# EAGLE design EHDD_LAB_4 (EAGLE 7.7.0)
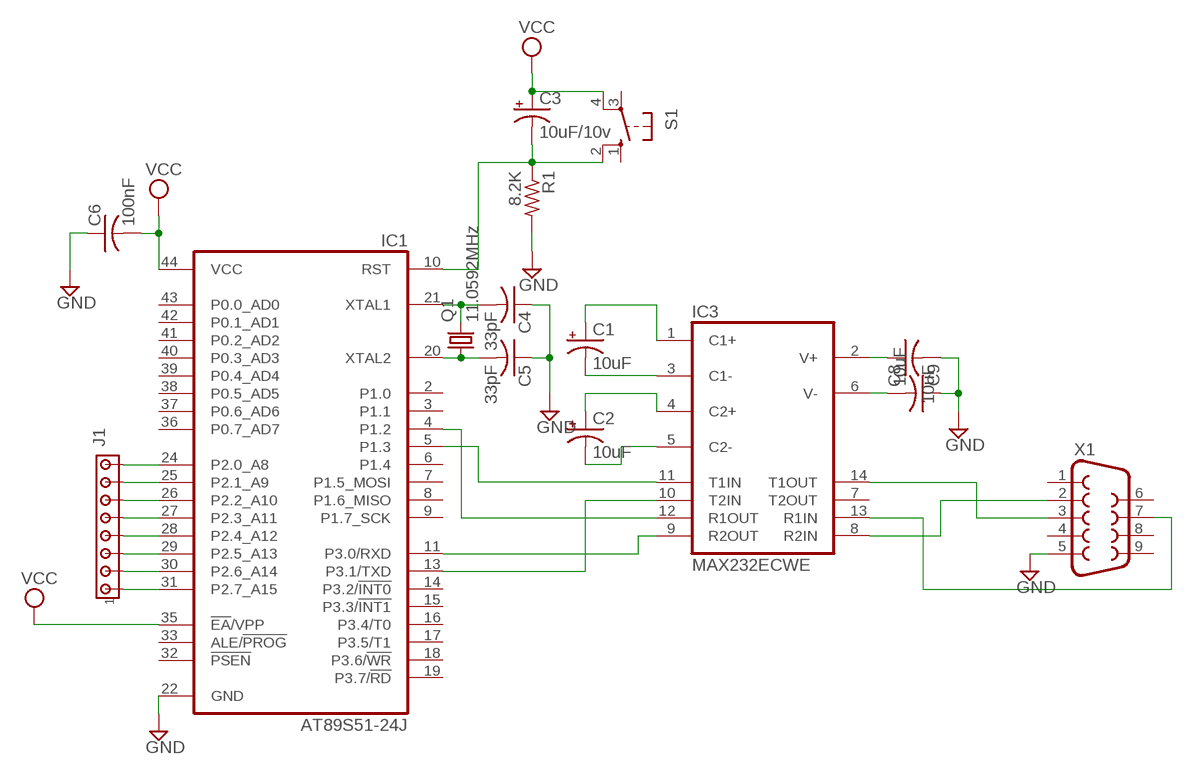
[diagram p0: schematic, sheet 1]

## Parts
C1  10uF  CPOL-US153CLV-0405  [153CLV-0405]
C2  10uF  CPOL-US153CLV-0405  [153CLV-0405]
C3  10uF/10v  CPOL-US153CLV-0405  [153CLV-0405]
C4  33pF  C-USC0805  [C0805]
C5  33pF  C-USC0805  [C0805]
C6  100nF  C-USC0805  [C0805]
C8  10uF  C-USC0805  [C0805]
C9  10uF  C-USC0805  [C0805]
IC1  AT89S51-24J  [PLCC44]
IC3  MAX232ECWE  [SO16L]
J1  MTA08-100  [10X08MTA]
Q1  11.0592MHz  CRYSTALTC38H  [TC38H]
R1  8.2K  R-US_R0805  [R0805]
S1  10-XX  [B3F-10XX]
X1  F09V  [F09V]

## Nets
GND: C4.1 C5.1 C6.1 C8.2 C9.1 IC1.22(GND) R1.2 X1.5
N$1: IC1.5(P1.3) IC3.11(T1IN)
N$2: IC1.13(P3.1/TXD) IC3.10(T2IN)
N$3: IC1.4(P1.2) IC3.12(R1OUT)
N$4: IC1.11(P3.0/RXD) IC3.9(R2OUT)
N$5: C2.- IC3.5(C2-)
N$6: C2.+ IC3.4(C2+)
N$7: C1.- IC3.3(C1-)
N$8: C1.+ IC3.1(C1+)
N$9: C9.2 IC3.6(V-)
N$10: C8.1 IC3.2(V+)
N$12: IC3.14(T1OUT) X1.3
N$13: IC3.8(R2IN) X1.2
N$14: IC3.13(R1IN) X1.7
N$16: IC1.24(P2.0_A8) J1.8
N$17: IC1.25(P2.1_A9) J1.7
N$18: IC1.26(P2.2_A10) J1.6
N$19: IC1.27(P2.3_A11) J1.5
N$20: IC1.28(P2.4_A12) J1.4
N$21: IC1.29(P2.5_A13) J1.3
N$22: IC1.30(P2.6_A14) J1.2
N$23: IC1.31(P2.7_A15) J1.1
N$24: C5.2 IC1.20(XTAL2) Q1.1
N$25: C4.2 IC1.21(XTAL1) Q1.2
N$27: C3.- IC1.10(RST) R1.1 S1.2(S1)
VCC: C3.+ C6.2 IC1.35(!EA!/VPP) IC1.44(VCC) S1.4(P1)
Unconnected: IC1.2(P1.0) IC1.3(P1.1) IC1.6(P1.4) IC1.7(P1.5_MOSI) IC1.8(P1.6_MISO) IC1.9(P1.7_SCK) IC1.14(P3.2/!INT0) IC1.15(P3.3/!INT1) IC1.16(P3.4/T0) IC1.17(P3.5/T1) IC1.18(P3.6/!WR) IC1.19(P3.7/!RD) IC1.32(!PSEN) IC1.33(ALE/!PROG) IC1.36(P0.7_AD7) IC1.37(P0.6_AD6) IC1.38(P0.5_AD5) IC1.39(P0.4_AD4) IC1.40(P0.3_AD3) IC1.41(P0.2_AD2) IC1.42(P0.1_AD1) IC1.43(P0.0_AD0) IC3.7(T2OUT) S1.1(S) S1.3(P) X1.1 X1.4 X1.6 X1.8 X1.9

## Power pins joined to a net without a drawn wire
GND: IC3.15(GND)
VCC: IC3.16(VCC)

## Library data of the parts
C1-C3 = rcl:CPOL-US: POLARIZED CAPACITOR, American symbol
C4-C6 C8 C9 = rcl:C-US: CAPACITOR, American symbol
IC1 = atmel:AT89S51-*: 8-bit Microcontroller with 4K BytesIn-System Programmable Flash Source: http://www.atmel.com/dyn/resources/prod_documents/doc2487.pdf; MPN: AT89S51-24JU; OC_FARNELL: 1095738; OC_NEWARK: 96K6577
IC3 = maxim:MAX232ECWE: RS232 TRANSCEIVER; MF: MAXIM; MPN: MAX232ECWE+; OC_FARNELL: 9724435; OC_NEWARK: 67K4440
J1 = con-amp:MTA08-100: AMP connector
Q1 = crystal:CRYSTAL: CRYSTAL; OC_FARNELL: unknown; OC_NEWARK: unknown
R1 = rcl:R-US_: RESISTOR, American symbol
S1 = switch-omron:10-XX: OMRON SWITCH; MPN: B3F-1000; OC_FARNELL: 176432; OC_NEWARK: 36M3542
X1 = con-subd:F09: SUB-D; OC_FARNELL: unknown; OC_NEWARK: unknown

## Board
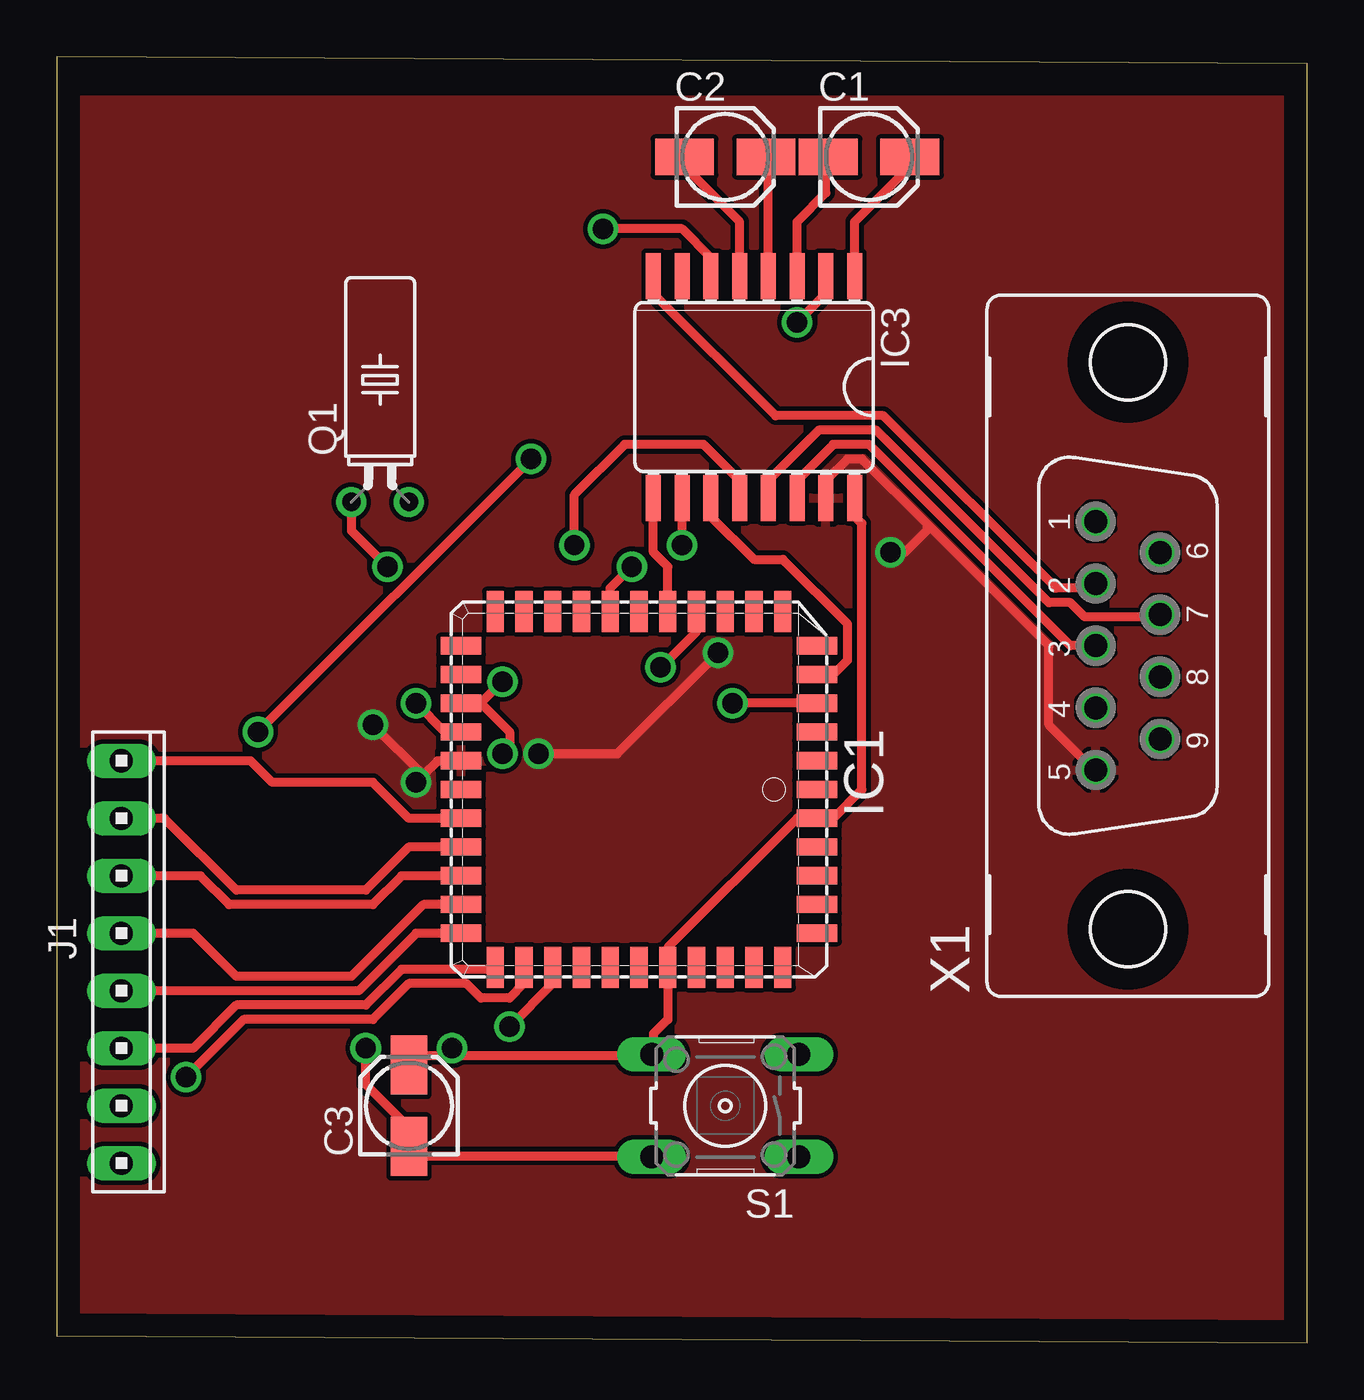
[diagram p1: board, top side]
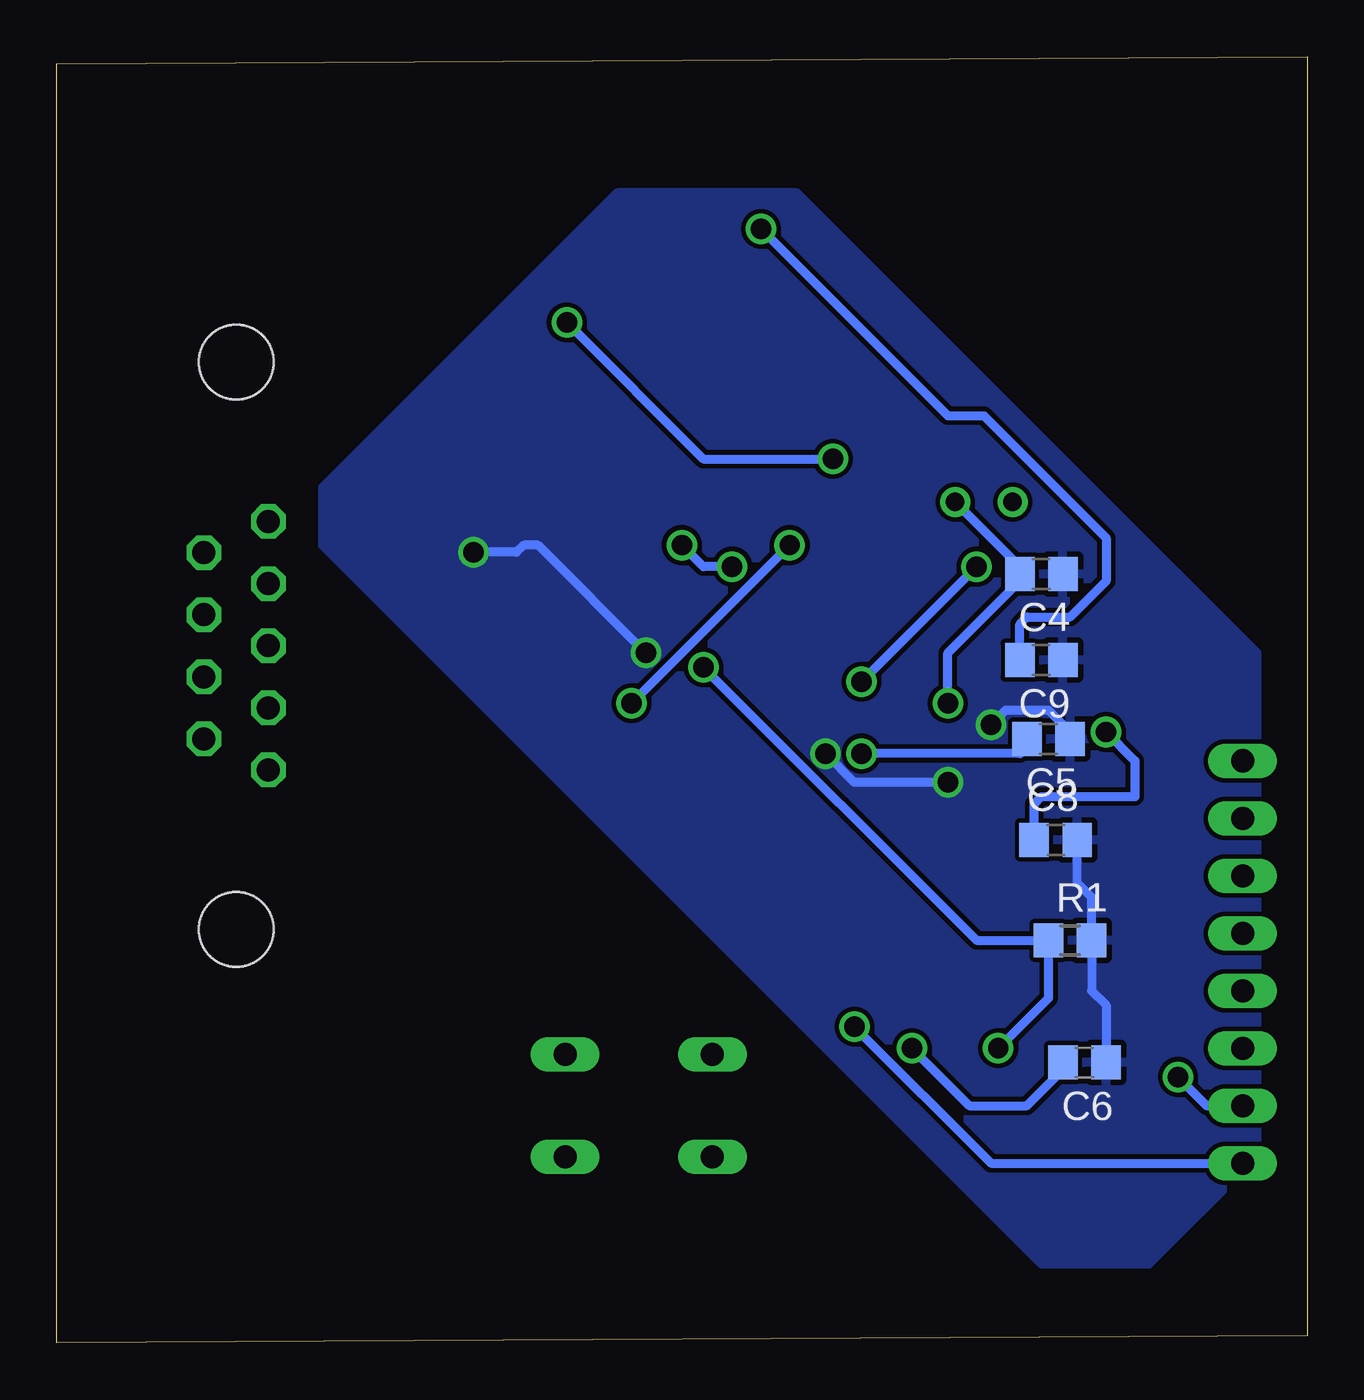
[diagram p2: board, bottom side, seen from below]

Size 55.23 x 56.82 mm. Coordinates in mm from the lower left corner, seen from the top.
Outline: 0,0.32 55.23,0 55.23,56.51 0,56.82 0,0.32
Copper layers (1*16): Top 0.035mm / dielectric 1.5mm / Bottom 0.035mm
Design rules "default": minimum track width 10mil, minimum drill 24mil, track to track 8mil, track to pad 8mil, pad to pad 8mil, via to via 8mil, smd to smd 8mil, copper to edge 40mil, drill to drill 8mil, minimum pad ring 10mil, minimum via ring 8mil, stop-mask expansion 4mil, vias tented up to drill 0mil, thermal gap 10mil

### Footprints (pad centres in the part's own frame; a part is rotated, then mirrored left to right if it is on the bottom)
153CLV-0405 = smd 2.6 x 1.6: + 1.8,0; - -1.8,0
C0805 = smd 1.3 x 1.5: 1 -0.95,0; 2 0.95,0
PLCC44 = smd 1.8 x 0.76: 1 -7.86,0; 2 -7.86,-1.27; 3 -7.86,-2.54; 4 -7.86,-3.81; 5 -7.86,-5.08; 6 -7.86,-6.35; 18 7.86,-6.35; 19 7.86,-5.08; 20 7.86,-3.81; 21 7.86,-2.54; 22 7.86,-1.27; 23 7.86,0; 24 7.86,1.27; 25 7.86,2.54; 26 7.86,3.81; 27 7.86,5.08; 28 7.86,6.35; 40 -7.86,6.35; 41 -7.86,5.08; 42 -7.86,3.81; 43 -7.86,2.54; 44 -7.86,1.27 | smd 0.76 x 1.8: 7 -6.35,-7.86; 8 -5.08,-7.86; 9 -3.81,-7.86; 10 -2.54,-7.86; 11 -1.27,-7.86; 12 0,-7.86; 13 1.27,-7.86; 14 2.54,-7.86; 15 3.81,-7.86; 16 5.08,-7.86; 17 6.35,-7.86; 29 6.35,7.86; 30 5.08,7.86; 31 3.81,7.86; 32 2.54,7.86; 33 1.27,7.86; 34 0,7.86; 35 -1.27,7.86; 36 -2.54,7.86; 37 -3.81,7.86; 38 -5.08,7.86; 39 -6.35,7.86
SO16L = smd 0.66 x 2.032: 1 -4.445,-4.902; 2 -3.175,-4.902; 3 -1.905,-4.902; 4 -0.635,-4.902; 5 0.635,-4.902; 6 1.905,-4.902; 7 3.175,-4.902; 8 4.445,-4.902; 9 4.445,4.902; 10 3.175,4.902; 11 1.905,4.902; 12 0.635,4.902; 13 -0.635,4.902; 14 -1.905,4.902; 15 -3.175,4.902; 16 -4.445,4.902
10X08MTA = drill 1.016 long: 1 8.89,0; 2 6.35,0; 3 3.81,0; 4 1.27,0; 5 -1.27,0; 6 -3.81,0; 7 -6.35,0; 8 -8.89,0
TC38H = drill 0.813: 1 -1.27,0; 2 1.27,0
R0805 = smd 1.3 x 1.5: 1 -0.95,0; 2 0.95,0
B3F-10XX = drill 1.016 long: 1 -3.251,2.261; 2 3.251,2.261; 3 -3.251,-2.261; 4 3.251,-2.261
F09V = drill 1.016 octagon: 1 5.486,1.422; 2 2.743,1.422; 3 0,1.422; 4 -2.743,1.422; 5 -5.486,1.422; 6 4.115,-1.422; 7 1.372,-1.422; 8 -1.372,-1.422; 9 -4.115,-1.422 | hole 3.302: -12.522,0; 12.522,0

### Placement (x,y rotation side)
C1  35.88,52.39 0 top
C2  29.53,52.39 0 top
C3  15.56,10.48 90 top
C4  11.75,33.97 180 bottom
C5  11.43,26.67 180 bottom
C6  9.84,12.38 180 bottom
C8  11.11,22.22 0 bottom
C9  11.75,30.16 180 bottom
IC1  25.72,24.45 180 top
IC3  30.8,42.23 180 top
J1  2.86,16.83 270 top
Q1  14.29,37.15 0 top
R1  10.48,17.78 0 bottom
S1  29.53,10.48 180 top
X1  47.31,30.8 90 top

### Tracks (layer width: path | path; a pad name or v marks a point on that pad's centre or on a via)
GND  (via drill 0.9)
  Top 0.406: IC3.15 33.97,38.1 34.92,39.05 35.56,39.05 38.42,36.19 | 38.42,36.19 43.81,30.8 43.81,27.31 45.72,25.4 X1.5 | 38.42,36.19 38.42,35.88 37.47,34.93 v36.83,34.93 | v29.21,30.48 24.77,26.04 v21.27,26.04 | 16.19,25.08 16.83,25.72 IC1.22 | v13.97,27.31 16.19,25.08 | 16.19,25.08 v15.88,24.77
  Bottom 0.406: R1.2 9.53,15.56 8.89,14.92 C6.1 | R1.2 9.53,19.68 10.16,20.32 C8.2 | R1.2 | v36.83,34.93 34.92,34.93 34.61,35.24 33.97,35.24 v29.21,30.48 | v21.27,26.04 20,24.77 v15.88,24.77 | v13.97,27.31 13.34,27.94 11.43,27.94 10.48,26.99 C5.1
  pour Top: 0,54.93 54.61,54.93 54.61,0.32 0,0.32
  pour Bottom: 22.54,50.8 30.48,50.8 43.5,37.78 43.5,35.24 11.75,3.49 6.99,3.49 2.22,8.26 2.22,30.48
N$1
  Top 0.406: IC3.11 28.89,36.51 30.8,34.61 32.07,34.61 34.92,31.75 34.92,30.16 34.29,29.53 IC1.5
N$2  (via drill 0.9)
  Top 0.406: v27.62,35.24 IC3.10 | v25.4,34.29 24.45,33.34 IC1.13
  Bottom 0.406: v27.62,35.24 26.67,34.29 v25.4,34.29
N$3  (via drill 0.9)
  Top 0.406: IC3.12 30.16,38.1 28.57,39.69 25.08,39.69 22.86,37.47 v22.86,35.24 | IC1.4 v29.84,28.26
  Bottom 0.406: v29.84,28.26 v22.86,35.24
N$4
  Top 0.406: IC3.9 26.35,34.93 26.99,34.29 IC1.11
N$5
  Top 0.406: IC3.5 30.16,49.53 27.94,51.75 27.94,52.39 C2.-
N$6
  Top 0.406: IC3.4 31.43,52.39 C2.+
N$7
  Top 0.406: IC3.3 32.7,49.53 33.97,50.8 33.97,52.39 C1.-
N$8
  Top 0.406: IC3.1 35.24,49.53 37.47,51.75 37.47,52.39 C1.+
N$9  (via drill 0.9)
  Top 0.406: v24.13,49.21 27.62,49.21 28.89,47.94 IC3.6
  Bottom 0.406: C9.2 12.7,31.75 12.38,32.07 10.48,32.07 8.89,33.65 8.89,35.56 14.29,40.96 15.88,40.96 v24.13,49.21
N$10  (via drill 0.9)
  Top 0.406: v20.95,39.05 v8.89,26.99 | v32.7,45.08 33.97,46.36 IC3.2
  Bottom 0.406: C8.1 12.06,23.81 11.75,24.13 7.62,24.13 7.62,25.72 v8.89,26.99 | v20.95,39.05 26.67,39.05 v32.7,45.08
N$12
  Top 0.406: IC3.14 32.7,38.1 34.29,39.69 35.88,39.69 44.77,30.8 X1.3
N$13
  Top 0.406: IC3.8 26.35,46.36 31.75,40.96 36.51,40.96 44.13,33.34 45.72,33.34 X1.2
N$14
  Top 0.406: IC3.13 31.43,38.1 33.66,40.32 36.2,40.32 43.81,32.7 44.77,32.7 45.4,32.07 48.58,32.07 X1.7
N$16
  Top 0.406: J1.8 8.57,25.72 9.53,24.77 13.97,24.77 15.56,23.18 IC1.24
N$17
  Top 0.406: J1.7 4.76,23.18 7.94,20 13.65,20 15.56,21.91 IC1.25
N$18
  Top 0.406: J1.6 6.35,20.64 7.62,19.37 13.97,19.37 15.24,20.64 IC1.26
N$19
  Top 0.406: J1.5 6.03,18.1 7.94,16.19 13.02,16.19 16.19,19.37 IC1.27
N$20
  Top 0.406: J1.4 13.34,15.56 15.88,18.1 IC1.28
N$21
  Top 0.406: J1.3 6.03,13.02 7.94,14.92 13.65,14.92 15.24,16.51 19.37,16.51 IC1.29
N$22  (via drill 0.9)
  Top 0.406: v5.71,11.75 8.26,14.29 13.97,14.29 15.56,15.87 18.1,15.87 18.73,15.24 20,15.24 20.64,15.87 IC1.30
  Bottom 0.406: J1.2 4.45,10.48 v5.71,11.75
N$23  (via drill 0.9)
  Top 0.406: v20,13.97 21.91,15.87 IC1.31
  Bottom 0.406: J1.1 13.97,7.94 v20,13.97
N$24  (via drill 0.9)
  Top 0.406: 18.73,28.26 20,26.99 20,25.72 v19.68,26.04 | v19.68,29.21 18.73,28.26 | v14.61,34.29 13.02,35.88 Q1.1 | 18.73,28.26 IC1.20
  Bottom 0.406: v19.68,26.04 12.7,26.04 12.06,26.67 C5.2 | v14.61,34.29 v19.68,29.21
N$25  (via drill 0.9)
  Top 0.406: v15.88,28.26 17.14,26.99 IC1.21
  Bottom 0.406: Q1.2 12.7,34.29 C4.2 12.38,33.97 15.88,30.48 v15.88,28.26
N$27  (via drill 0.9)
  Top 0.406: S1.2 26.04,8.26 15.56,8.26 C3.- 15.56,9.52 13.65,11.43 v13.65,13.02 | v26.67,29.84 28.26,31.43 IC1.10
  Bottom 0.406: R1.1 11.43,15.24 v13.65,13.02 | R1.1 14.61,17.78 v26.67,29.84 | R1.1
VCC  (via drill 0.9)
  Top 0.406: 17.46,12.7 15.56,12.7 C3.+ | 17.46,12.7 26.04,12.7 S1.4 26.35,13.02 26.35,13.65 26.99,14.29 IC1.35 26.99,17.46 32.7,23.18 IC1.44 34.29,23.18 35.56,24.45 35.56,36.19 35.24,36.51 IC3.16 | 17.46,12.7 v17.46,13.02
  Bottom 0.406: C6.2 10.48,12.38 12.38,10.48 14.92,10.48 v17.46,13.02